# Altium schematic sheet HT7560.SchDoc
size A4
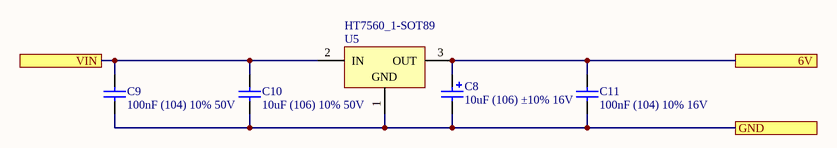
[diagram p0: HT7560.SchDoc]

## Parts
C8  10uF (106) ±10% 16V  [CASE-A_3216]
C9  100nF (104) 10% 50V  [0603_C]
C10  10uF (106) 10% 50V  [1206_C]
C11  100nF (104) 10% 16V  [0402_C]
U5  HT7560_1-SOT89  [SOT89_N]

## Ports
6V, GND, VIN

## Nets
6V: C8.1 C11.1 U5.3(OUT) ; port 6V
GND: C8.2 C9.1 C10.2 C11.2 U5.1(GND) ; port GND
VIN: C9.2 C10.1 U5.2(IN) ; port VIN

## Library data of the parts
C8 = 3216 10uF (106) 10% 16V: 钽电容; ComponentLink1Description: 供应商链接; ComponentLink1URL: http://www.szlcsc.com/product/details_7643.html; Package: 3216; Supplier: LC; SuppliersPartNumber: C7171
C9 = 0603 100nF (104) 10% 50V: 贴片电容; ComponentLink1Description: 供应商链接; ComponentLink1URL: http://www.szlcsc.com/product/details_15331.html; Package: 0603; Supplier: LC; SuppliersPartNumber: C14663
C10 = 1206 10uF (106) 10% 50V: 贴片电容; ComponentLink1Description: 供应商链接; ComponentLink1URL: http://www.szlcsc.com/product/details_14236.html; Package: 1206; Supplier: LC; SuppliersPartNumber: C13585
C11 = 0402 100nF (104) 10% 16V: 贴片电容; ComponentLink1Description: 供应商链接; ComponentLink1URL: http://www.szlcsc.com/product/details_1877.html; Package: 0402; Supplier: LC; SuppliersPartNumber: C1525
U5 = HT7560_1-SOT89: 100mA Low Power LDO, Output Voltage 6.0V, SOT89 Pkg; DatasheetVersion: Rev1.80, Mar-2010; PackageVersion: 25/05/2010; PackageReference: SOT89; PackageDescription: 3-Pin SOT-89 Package 1.5 mm Pitch, 4.1 mm Lead Span; Code_IPC: SOT89; ComponentLink1Description: Manufacturer URL; ComponentLink1URL: http://www.holtek.com/; ComponentLink2Description: Datasheet; ComponentLink2URL: http://www.holtek.com/pdf/consumer/75xx_1v180.pdf; ComponentLink3Description: Package Specification; ComponentLink3URL: http://www.holtek.com/english/literature/package.pdf